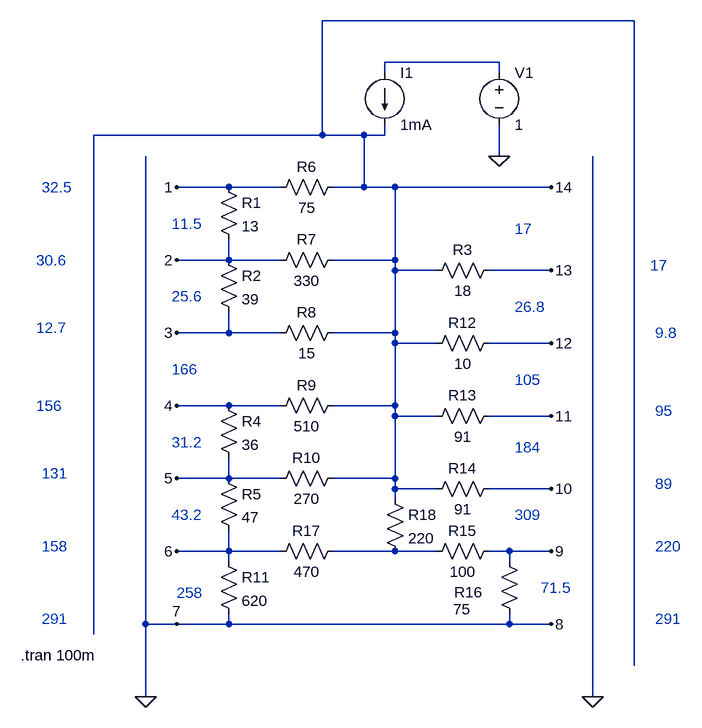
[diagram p0: schematic NetRes 16055375.asc]
NetRes 16055375.asc, the LTspice schematic file:
Version 4
SHEET 1 992 868
WIRE 816 -192 336 -192
WIRE 608 -128 432 -128
WIRE 432 -112 432 -128
WIRE 608 -112 608 -128
WIRE 336 -16 336 -192
WIRE 336 -16 -16 -16
WIRE 400 -16 336 -16
WIRE 432 -16 432 -32
WIRE 432 -16 400 -16
WIRE 608 16 608 -32
WIRE 192 64 112 64
WIRE 272 64 192 64
WIRE 400 64 400 -16
WIRE 400 64 352 64
WIRE 448 64 400 64
WIRE 688 64 448 64
WIRE 192 176 192 144
WIRE 192 176 112 176
WIRE 272 176 192 176
WIRE 448 176 448 64
WIRE 448 176 352 176
WIRE 448 192 448 176
WIRE 512 192 448 192
WIRE 688 192 592 192
WIRE 192 288 192 256
WIRE 192 288 112 288
WIRE 272 288 192 288
WIRE 448 288 448 192
WIRE 448 288 352 288
WIRE 448 304 448 288
WIRE 512 304 448 304
WIRE 688 304 592 304
WIRE 192 400 112 400
WIRE 272 400 192 400
WIRE 448 400 448 304
WIRE 448 400 352 400
WIRE 448 416 448 400
WIRE 512 416 448 416
WIRE 688 416 592 416
WIRE 192 512 192 480
WIRE 192 512 112 512
WIRE 272 512 192 512
WIRE 448 512 448 416
WIRE 448 512 352 512
WIRE 448 528 448 512
WIRE 512 528 448 528
WIRE 688 528 592 528
WIRE 448 544 448 528
WIRE 192 624 192 592
WIRE 192 624 112 624
WIRE 272 624 192 624
WIRE 448 624 352 624
WIRE 512 624 448 624
WIRE 624 624 592 624
WIRE 688 624 624 624
WIRE 192 640 192 624
WIRE 624 640 624 624
WIRE 64 736 64 16
WIRE 112 736 64 736
WIRE 192 736 192 720
WIRE 192 736 112 736
WIRE 624 736 624 720
WIRE 624 736 192 736
WIRE 688 736 624 736
WIRE -16 752 -16 -16
WIRE 816 800 816 -192
WIRE 64 848 64 736
WIRE 752 848 752 16
FLAG 112 64 1
FLAG 112 176 2
FLAG 112 288 3
FLAG 112 400 4
FLAG 112 512 5
FLAG 112 624 6
FLAG 608 16 0
FLAG 688 64 14
FLAG 688 192 13
FLAG 688 304 12
FLAG 688 416 11
FLAG 688 528 10
FLAG 688 624 9
FLAG 688 736 8
FLAG 112 736 7
FLAG 752 848 0
FLAG 64 848 0
SYMBOL res 176 48 R0
SYMATTR InstName R1
SYMATTR Value 13
SYMBOL res 176 384 R0
SYMATTR InstName R4
SYMATTR Value 36
SYMBOL res 176 496 R0
SYMATTR InstName R5
SYMATTR Value 47
SYMBOL res 368 48 R90
WINDOW 0 0 56 VBottom 2
WINDOW 3 32 56 VTop 2
SYMATTR InstName R6
SYMATTR Value 75
SYMBOL res 368 160 R90
WINDOW 0 0 56 VBottom 2
WINDOW 3 32 56 VTop 2
SYMATTR InstName R7
SYMATTR Value 330
SYMBOL res 368 272 R90
WINDOW 0 0 56 VBottom 2
WINDOW 3 32 56 VTop 2
SYMATTR InstName R8
SYMATTR Value 15
SYMBOL res 368 384 R90
WINDOW 0 0 56 VBottom 2
WINDOW 3 32 56 VTop 2
SYMATTR InstName R9
SYMATTR Value 510
SYMBOL res 368 496 R90
WINDOW 0 0 56 VBottom 2
WINDOW 3 32 56 VTop 2
SYMATTR InstName R10
SYMATTR Value 270
SYMBOL current 432 -112 R0
WINDOW 123 0 0 Left 0
WINDOW 39 0 0 Left 0
SYMATTR InstName I1
SYMATTR Value 1mA
SYMBOL voltage 608 -128 R0
WINDOW 123 0 0 Left 0
WINDOW 39 0 0 Left 0
SYMATTR InstName V1
SYMATTR Value 1
SYMBOL res 176 160 R0
SYMATTR InstName R2
SYMATTR Value 39
SYMBOL res 608 176 R90
WINDOW 0 0 56 VBottom 2
WINDOW 3 32 56 VTop 2
SYMATTR InstName R3
SYMATTR Value 18
SYMBOL res 608 288 R90
WINDOW 0 0 56 VBottom 2
WINDOW 3 32 56 VTop 2
SYMATTR InstName R12
SYMATTR Value 10
SYMBOL res 608 400 R90
WINDOW 0 0 56 VBottom 2
WINDOW 3 32 56 VTop 2
SYMATTR InstName R13
SYMATTR Value 91
SYMBOL res 608 512 R90
WINDOW 0 0 56 VBottom 2
WINDOW 3 32 56 VTop 2
SYMATTR InstName R14
SYMATTR Value 91
SYMBOL res 608 608 R90
WINDOW 0 0 56 VBottom 2
WINDOW 3 32 56 VTop 2
SYMATTR InstName R15
SYMATTR Value 100
SYMBOL res 368 608 R90
WINDOW 0 0 56 VBottom 2
WINDOW 3 32 56 VTop 2
SYMATTR InstName R17
SYMATTR Value 470
SYMBOL res 608 624 R0
WINDOW 0 -69 63 Left 2
WINDOW 3 -71 89 Left 2
SYMATTR InstName R16
SYMATTR Value 75
SYMBOL res 176 624 R0
SYMATTR InstName R11
SYMATTR Value 620
SYMBOL res 432 528 R0
SYMATTR InstName R18
SYMATTR Value 220
TEXT -128 784 Left 2 !.tran 100m
TEXT -96 64 Left 2 ;32.5
TEXT -104 176 Left 2 ;30.6
TEXT -104 280 Left 2 ;12.7
TEXT -104 400 Left 2 ;156
TEXT -96 504 Left 2 ;131
TEXT -96 616 Left 2 ;158
TEXT -96 728 Left 2 ;291
TEXT 840 184 Left 2 ;17
TEXT 848 288 Left 2 ;9.8
TEXT 848 408 Left 2 ;95
TEXT 848 520 Left 2 ;89
TEXT 848 616 Left 2 ;220
TEXT 848 728 Left 2 ;291
TEXT 104 120 Left 2 ;11.5
TEXT 104 232 Left 2 ;25.6
TEXT 104 344 Left 2 ;166
TEXT 104 456 Left 2 ;31.2
TEXT 104 568 Left 2 ;43.2
TEXT 112 688 Left 2 ;258
TEXT 632 128 Left 2 ;17
TEXT 632 248 Left 2 ;26.8
TEXT 632 360 Left 2 ;105
TEXT 632 464 Left 2 ;184
TEXT 632 568 Left 2 ;309
TEXT 672 680 Left 2 ;71.5

The netlist it stands for:
* NetRes 16055375.asc
R1 1 2 13
R4 4 5 36
R5 5 6 47
R6 14 1 75
R7 14 2 330
R8 14 3 15
R9 14 4 510
R10 14 5 270
I1 N001 14 1mA
V1 N001 0 1
R2 2 3 39
R3 13 14 18
R12 12 14 10
R13 11 14 91
R14 10 14 91
R15 9 N002 100
R17 N002 6 470
R16 9 0 75
R11 6 0 620
R18 14 N002 220
.tran 100m
* 32.5
* 30.6
* 12.7
* 156
* 131
* 158
* 291
* 17
* 9.8
* 95
* 89
* 220
* 291
* 11.5
* 25.6
* 166
* 31.2
* 43.2
* 258
* 17
* 26.8
* 105
* 184
* 309
* 71.5
.backanno
.end